# Altium schematic sheet EMCO DC-DC.SchDoc: EMCO DC-DC Converter
size A4; Author: Khoi Ly; DrawnBy: Khoi Ly; Organization: University of Colorado; Address1: 1111 Engineering Drive; Address2: Boulder; Address3: CO, 870309; Address4: USA; DocumentNumber: 1; Revision: 1; SheetNumber: 1; SheetTotal: 4; DocumentFullPathAndName: EMCO DC-DC.SchDoc
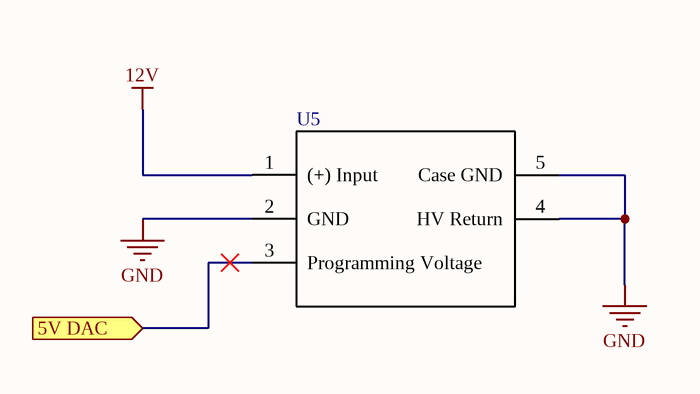
[diagram p0: EMCO DC-DC.SchDoc]

## Parts
U5  C80  [C80]  (value not drawn)

## Ports
5V DAC (in)

## Nets
12V: U5.1((+)_Input)
GND: U5.2(GND) U5.4(HV_Return) U5.5(Case_GND)
5V DAC: U5.3(Programming_Voltage) ; port 5V DAC

## Notes on the sheet
- Title
- Size:
- Date:
- A4
- Number:
- Time:
- Revision:
- Sheet
- of
- File:

## Library data of the parts
U5 = C80: DC DC CONVERTER 8000V 1W; Manufacturer: XP Power; Package: 5-DIP Module; Manufacturer Part Number: C80; Digikey Part Number: 1470-3260-ND; Unit Price: $393.30; Supplier: Digikey